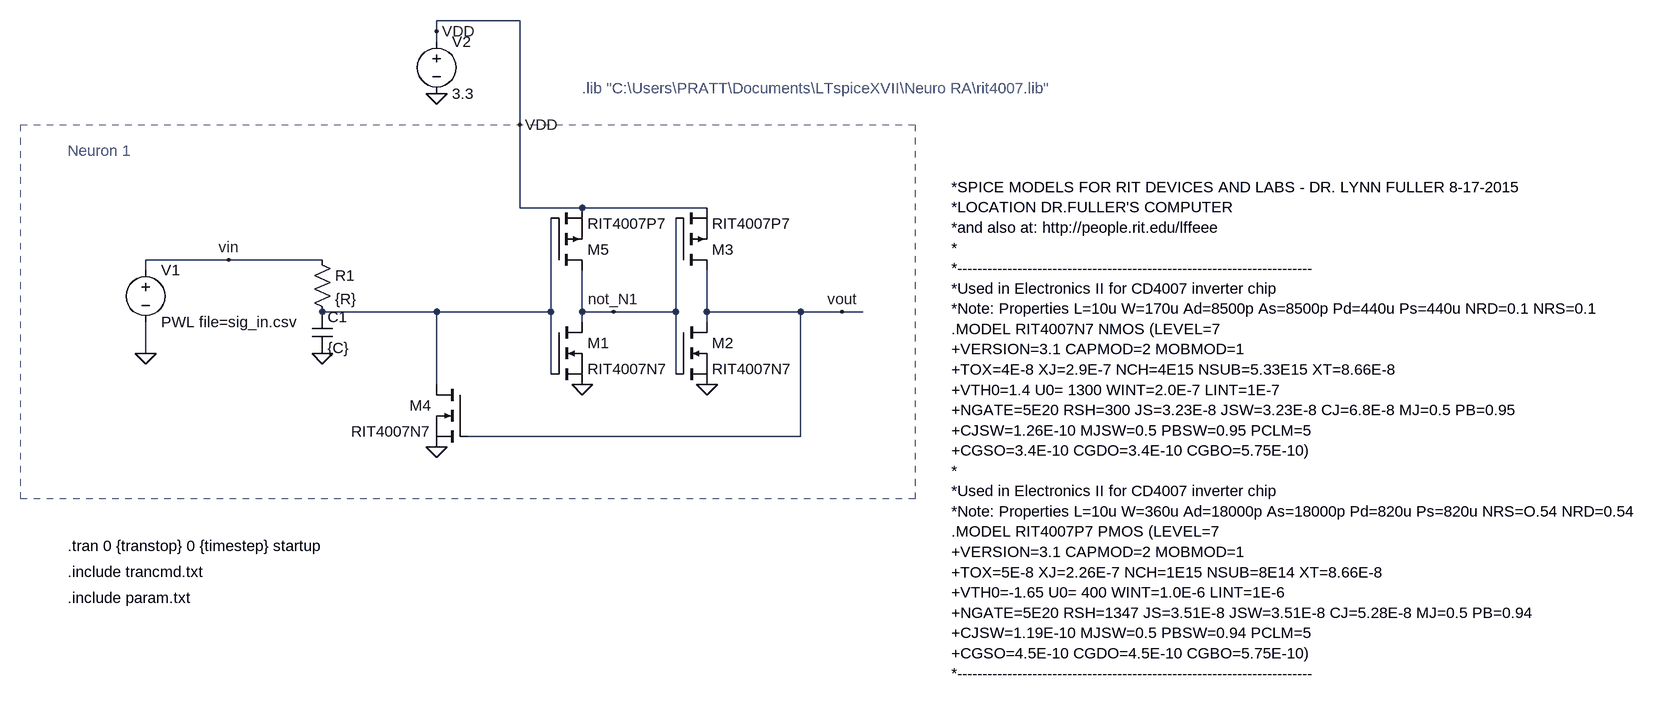
[diagram p0: schematic newneuron.asc]
newneuron.asc, the LTspice schematic file:
Version 4
SHEET 1 2004 704
WIRE 176 -240 48 -240
WIRE 48 -224 48 -240
WIRE 48 -208 48 -224
WIRE 176 -80 176 -240
WIRE 176 48 176 -80
WIRE 272 48 176 48
WIRE 464 48 272 48
WIRE -272 128 -400 128
WIRE -128 128 -272 128
WIRE -400 144 -400 128
WIRE 48 208 -128 208
WIRE 224 208 224 64
WIRE 224 208 48 208
WIRE 272 208 272 144
WIRE 320 208 272 208
WIRE 416 208 416 64
WIRE 416 208 320 208
WIRE 464 208 464 144
WIRE 608 208 464 208
WIRE 672 208 608 208
WIRE 704 208 672 208
WIRE 272 224 272 208
WIRE 464 224 464 208
WIRE -400 272 -400 224
WIRE 224 304 224 208
WIRE 416 304 416 208
WIRE 48 320 48 208
WIRE 608 400 608 208
WIRE 608 400 96 400
FLAG 48 416 0
FLAG 272 320 0
FLAG 464 320 0
FLAG -128 272 0
FLAG 48 -128 0
FLAG 48 -224 VDD
FLAG 320 208 not_N1
FLAG 176 -80 VDD
FLAG -400 272 0
FLAG -272 128 vin
FLAG 672 208 vout
SYMBOL nmos 224 224 R0
SYMATTR InstName M1
SYMATTR Value RIT4007N7
SYMBOL nmos 416 224 R0
SYMATTR InstName M2
SYMATTR Value RIT4007N7
SYMBOL pmos 416 144 M180
SYMATTR InstName M3
SYMATTR Value RIT4007P7
SYMBOL nmos 96 320 M0
SYMATTR InstName M4
SYMATTR Value RIT4007N7
SYMBOL cap -144 208 R0
SYMATTR InstName C1
SYMATTR Value {C}
SYMBOL res -144 112 R0
SYMATTR InstName R1
SYMATTR Value {R}
SYMBOL voltage 48 -224 R0
WINDOW 123 0 0 Left 0
WINDOW 39 0 0 Left 0
SYMATTR InstName V2
SYMATTR Value 3.3
SYMBOL pmos 224 144 M180
SYMATTR InstName M5
SYMATTR Value RIT4007P7
SYMBOL voltage -400 128 R0
WINDOW 39 0 0 Left 0
SYMATTR InstName V1
SYMATTR Value PWL file=sig_in.csv
TEXT -520 -40 Left 2 ;Neuron 1
TEXT 272 -136 Left 2 ;.lib "C:\\Users\\PRATT\\Documents\\LTspiceXVII\\Neuro RA\\rit4007.lib"
TEXT 840 16 Left 2 !*SPICE MODELS FOR RIT DEVICES AND LABS - DR. LYNN FULLER 8-17-2015\n*LOCATION DR.FULLER'S COMPUTER\n*and also at: http://people.rit.edu/lffeee\n*\n*-----------------------------------------------------------------------\n*Used in Electronics II for CD4007 inverter chip\n*Note: Properties L=10u W=170u Ad=8500p As=8500p Pd=440u Ps=440u NRD=0.1 NRS=0.1\n.MODEL RIT4007N7 NMOS (LEVEL=7\n+VERSION=3.1 CAPMOD=2 MOBMOD=1\n+TOX=4E-8 XJ=2.9E-7 NCH=4E15 NSUB=5.33E15 XT=8.66E-8\n+VTH0=1.4 U0= 1300 WINT=2.0E-7 LINT=1E-7\n+NGATE=5E20 RSH=300 JS=3.23E-8 JSW=3.23E-8 CJ=6.8E-8 MJ=0.5 PB=0.95\n+CJSW=1.26E-10 MJSW=0.5 PBSW=0.95 PCLM=5\n+CGSO=3.4E-10 CGDO=3.4E-10 CGBO=5.75E-10)\n*\n*Used in Electronics II for CD4007 inverter chip\n*Note: Properties L=10u W=360u Ad=18000p As=18000p Pd=820u Ps=820u NRS=O.54 NRD=0.54\n.MODEL RIT4007P7 PMOS (LEVEL=7\n+VERSION=3.1 CAPMOD=2 MOBMOD=1\n+TOX=5E-8 XJ=2.26E-7 NCH=1E15 NSUB=8E14 XT=8.66E-8\n+VTH0=-1.65 U0= 400 WINT=1.0E-6 LINT=1E-6\n+NGATE=5E20 RSH=1347 JS=3.51E-8 JSW=3.51E-8 CJ=5.28E-8 MJ=0.5 PB=0.94\n+CJSW=1.19E-10 MJSW=0.5 PBSW=0.94 PCLM=5\n+CGSO=4.5E-10 CGDO=4.5E-10 CGBO=5.75E-10)\n*-----------------------------------------------------------------------
TEXT -520 568 Left 2 !.tran 0 {transtop} 0 {timestep} startup
TEXT -520 608 Left 2 !.include trancmd.txt
TEXT -520 648 Left 2 !.include param.txt
RECTANGLE Normal 784 496 -592 -80 2

The netlist it stands for:
* newneuron.asc
M1 not_N1 N001 0 0 RIT4007N7
M2 vout not_N1 0 0 RIT4007N7
M3 vout not_N1 VDD VDD RIT4007P7
M4 N001 vout 0 0 RIT4007N7
C1 N001 0 {C}
R1 vin N001 {R}
V2 VDD 0 3.3
M5 not_N1 N001 VDD VDD RIT4007P7
V1 vin 0 PWL file=sig_in.csv
.model NMOS NMOS
.model PMOS PMOS
.lib standard.mos
* Neuron 1
* .lib "C:\Users\PRATT\Documents\LTspiceXVII\Neuro RA\rit4007.lib"
*SPICE MODELS FOR RIT DEVICES AND LABS - DR. LYNN FULLER 8-17-2015
*LOCATION DR.FULLER'S COMPUTER
*and also at: http://people.rit.edu/lffeee
*
*-----------------------------------------------------------------------
*Used in Electronics II for CD4007 inverter chip
*Note: Properties L=10u W=170u Ad=8500p As=8500p Pd=440u Ps=440u NRD=0.1 NRS=0.1
.MODEL RIT4007N7 NMOS (LEVEL=7
+VERSION=3.1 CAPMOD=2 MOBMOD=1
+TOX=4E-8 XJ=2.9E-7 NCH=4E15 NSUB=5.33E15 XT=8.66E-8
+VTH0=1.4 U0= 1300 WINT=2.0E-7 LINT=1E-7
+NGATE=5E20 RSH=300 JS=3.23E-8 JSW=3.23E-8 CJ=6.8E-8 MJ=0.5 PB=0.95
+CJSW=1.26E-10 MJSW=0.5 PBSW=0.95 PCLM=5
+CGSO=3.4E-10 CGDO=3.4E-10 CGBO=5.75E-10)
*
*Used in Electronics II for CD4007 inverter chip
*Note: Properties L=10u W=360u Ad=18000p As=18000p Pd=820u Ps=820u NRS=O.54 NRD=0.54
.MODEL RIT4007P7 PMOS (LEVEL=7
+VERSION=3.1 CAPMOD=2 MOBMOD=1
+TOX=5E-8 XJ=2.26E-7 NCH=1E15 NSUB=8E14 XT=8.66E-8
+VTH0=-1.65 U0= 400 WINT=1.0E-6 LINT=1E-6
+NGATE=5E20 RSH=1347 JS=3.51E-8 JSW=3.51E-8 CJ=5.28E-8 MJ=0.5 PB=0.94
+CJSW=1.19E-10 MJSW=0.5 PBSW=0.94 PCLM=5
+CGSO=4.5E-10 CGDO=4.5E-10 CGBO=5.75E-10)
*-----------------------------------------------------------------------
.tran 0 {transtop} 0 {timestep} startup
.include trancmd.txt
.include param.txt
.backanno
.end